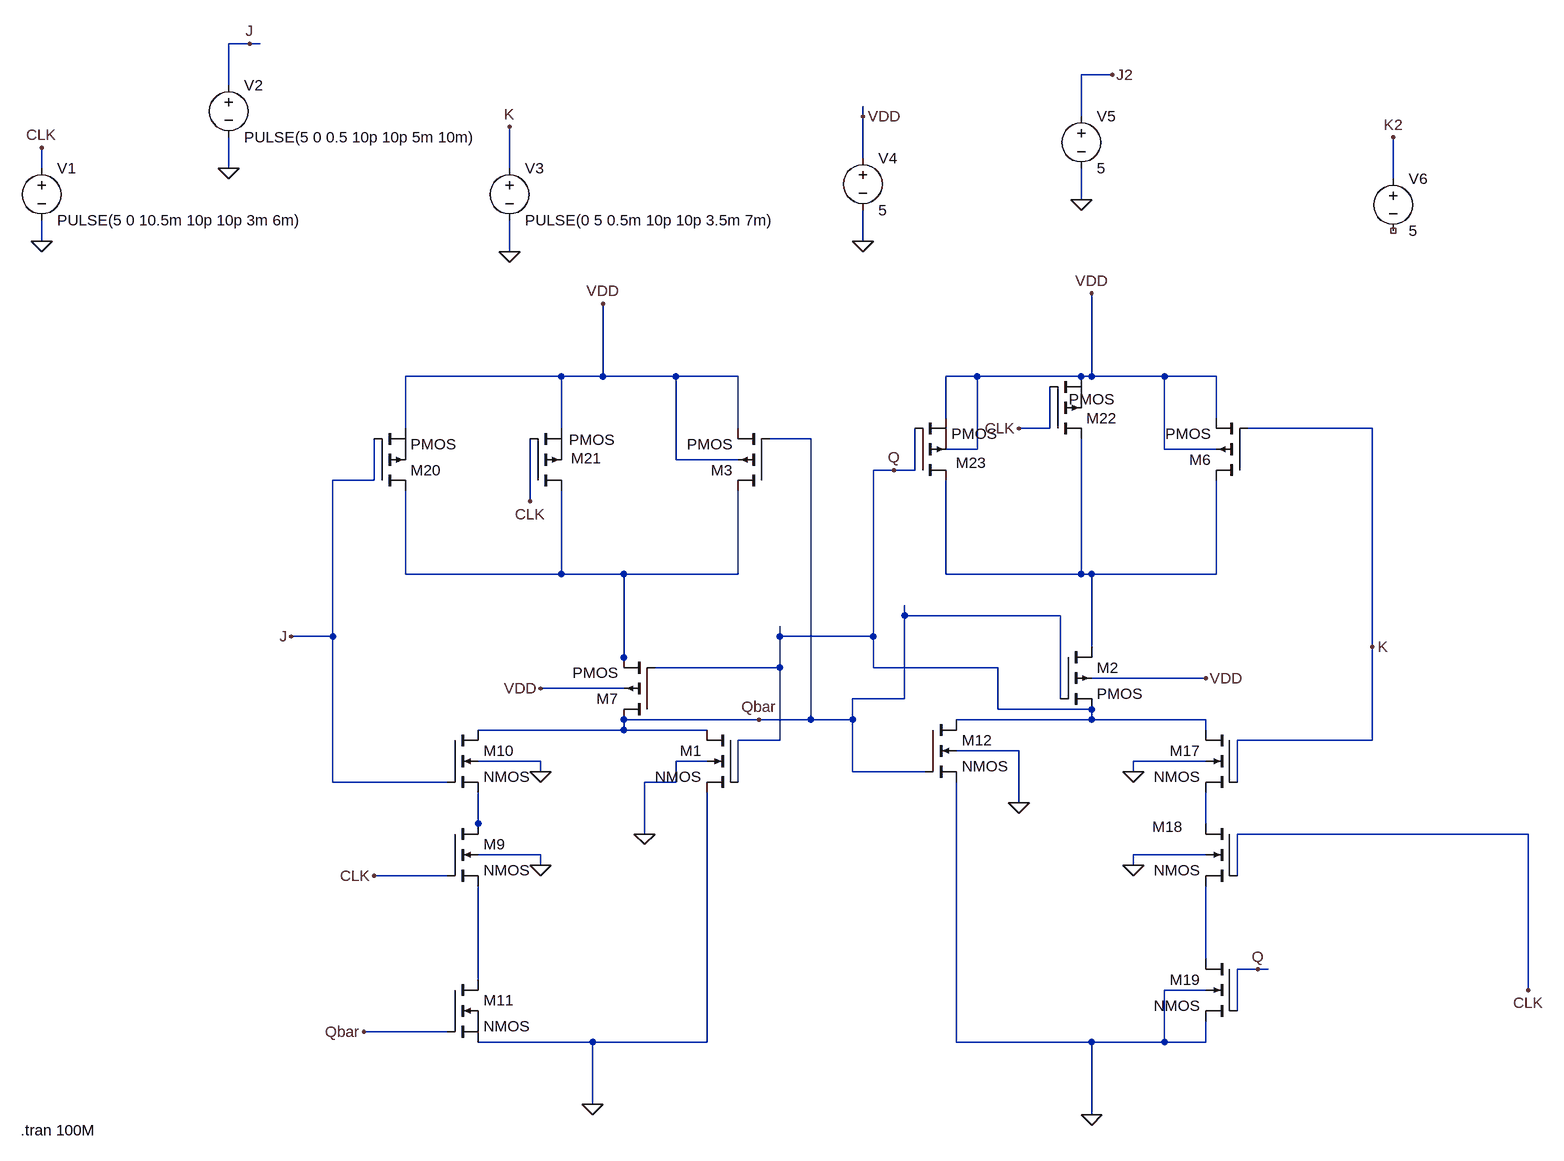
[diagram p0: schematic CIRCUITO.asc]
CIRCUITO.asc, the LTspice schematic file:
Version 4
SHEET 1 2232 1560
WIRE -128 -128 -160 -128
WIRE -112 -128 -128 -128
WIRE 1200 -80 1152 -80
WIRE -160 -64 -160 -128
WIRE 816 -16 816 -32
WIRE 1152 -16 1152 -80
WIRE 816 48 816 -16
WIRE -448 64 -448 32
WIRE -160 64 -160 16
WIRE 272 64 272 0
WIRE 1632 80 1632 16
WIRE 1152 112 1152 64
WIRE -448 176 -448 144
WIRE 816 176 816 128
WIRE 272 192 272 144
WIRE 352 384 112 384
WIRE 416 384 416 272
WIRE 416 384 352 384
WIRE 528 384 416 384
WIRE 624 384 528 384
WIRE 992 384 944 384
WIRE 1152 384 992 384
WIRE 1168 384 1168 256
WIRE 1168 384 1152 384
WIRE 1280 384 1168 384
WIRE 1360 384 1280 384
WIRE 944 448 944 384
WIRE 1360 448 1360 384
WIRE 112 464 112 384
WIRE 352 464 352 384
WIRE 624 464 624 384
WIRE 1104 464 1104 400
WIRE 1104 464 1056 464
WIRE 1600 464 1408 464
WIRE 736 480 672 480
WIRE 992 496 992 384
WIRE 992 496 944 496
WIRE 1280 496 1280 384
WIRE 1360 496 1280 496
WIRE 528 512 528 384
WIRE 624 512 528 512
WIRE 864 528 832 528
WIRE 896 528 896 464
WIRE 896 528 864 528
WIRE 64 544 64 480
WIRE 64 544 0 544
WIRE 304 576 304 480
WIRE 112 688 112 560
WIRE 352 688 352 560
WIRE 352 688 112 688
WIRE 448 688 352 688
WIRE 624 688 624 560
WIRE 624 688 448 688
WIRE 944 688 944 544
WIRE 1152 688 1152 480
WIRE 1152 688 944 688
WIRE 1168 688 1152 688
WIRE 1360 688 1360 544
WIRE 1360 688 1168 688
WIRE 880 752 880 736
WIRE 1120 752 880 752
WIRE 0 784 0 544
WIRE 0 784 -64 784
WIRE 688 784 688 768
WIRE 832 784 832 528
WIRE 832 784 688 784
WIRE 1168 800 1168 688
WIRE 1600 800 1600 464
WIRE 448 816 448 688
WIRE 448 832 448 816
WIRE 688 832 688 784
WIRE 688 832 496 832
WIRE 832 832 832 784
WIRE 1024 832 832 832
WIRE 1344 848 1168 848
WIRE 448 864 320 864
WIRE 880 880 880 752
WIRE 880 880 800 880
WIRE 1120 880 1120 752
WIRE 1024 896 1024 832
WIRE 1168 896 1024 896
WIRE 656 912 448 912
WIRE 736 912 736 480
WIRE 736 912 656 912
WIRE 800 912 800 880
WIRE 800 912 736 912
WIRE 1168 912 1168 896
WIRE 1168 912 960 912
WIRE 1344 912 1168 912
WIRE 448 928 448 912
WIRE 448 928 224 928
WIRE 576 928 448 928
WIRE 1344 928 1344 912
WIRE 688 944 688 832
WIRE 688 944 624 944
WIRE 1600 944 1600 800
WIRE 1600 944 1392 944
WIRE 1056 960 960 960
WIRE 320 976 224 976
WIRE 576 976 528 976
WIRE 1344 976 1232 976
WIRE 320 992 320 976
WIRE 800 992 800 912
WIRE 912 992 800 992
WIRE 1232 992 1232 976
WIRE 0 1008 0 784
WIRE 176 1008 0 1008
WIRE 528 1008 528 976
WIRE 528 1008 480 1008
WIRE 624 1008 624 944
WIRE 1392 1008 1392 944
WIRE 1056 1040 1056 960
WIRE 224 1072 224 1024
WIRE 1344 1072 1344 1024
WIRE 224 1088 224 1072
WIRE 480 1088 480 1008
WIRE 1840 1088 1392 1088
WIRE 320 1120 224 1120
WIRE 1344 1120 1232 1120
WIRE 320 1136 320 1120
WIRE 1232 1136 1232 1120
WIRE 176 1152 64 1152
WIRE 1392 1152 1392 1088
WIRE 1344 1280 1344 1168
WIRE 1424 1296 1392 1296
WIRE 1440 1296 1424 1296
WIRE 224 1312 224 1168
WIRE 1344 1328 1280 1328
WIRE 1840 1328 1840 1088
WIRE 1392 1360 1392 1296
WIRE 176 1392 48 1392
WIRE 400 1408 224 1408
WIRE 576 1408 576 1024
WIRE 576 1408 400 1408
WIRE 960 1408 960 1008
WIRE 1168 1408 960 1408
WIRE 1280 1408 1280 1328
WIRE 1280 1408 1168 1408
WIRE 1344 1408 1344 1376
WIRE 1344 1408 1280 1408
WIRE 400 1504 400 1408
WIRE 1168 1520 1168 1408
FLAG -448 176 0
FLAG -448 32 CLK
FLAG -160 64 0
FLAG 272 192 0
FLAG 320 992 0
FLAG 320 1136 0
FLAG 400 1504 0
FLAG 1168 1520 0
FLAG 1232 1136 0
FLAG 1232 992 0
FLAG 1056 1040 0
FLAG 1056 464 CLK
FLAG 64 1152 CLK
FLAG 1840 1328 CLK
FLAG 416 272 VDD
FLAG 1168 256 VDD
FLAG -64 784 J
FLAG 864 528 Q
FLAG 48 1392 Qbar
FLAG 1344 848 VDD
FLAG 320 864 VDD
FLAG 816 176 0
FLAG 816 -16 VDD
FLAG 656 912 Qbar
FLAG 480 1088 0
FLAG 304 576 CLK
FLAG 1152 112 0
FLAG 1200 -80 J2
FLAG 1632 16 K2
FLAG -128 -128 J
FLAG 272 0 K
FLAG 1424 1296 Q
FLAG 1600 800 K
SYMBOL voltage -448 48 R0
WINDOW 123 0 0 Left 0
WINDOW 39 0 0 Left 0
SYMATTR InstName V1
SYMATTR Value PULSE(5 0 10.5m 10p 10p 3m 6m)
SYMBOL voltage -160 -80 R0
WINDOW 123 0 0 Left 0
WINDOW 39 0 0 Left 0
SYMATTR InstName V2
SYMATTR Value PULSE(5 0 0.5 10p 10p 5m 10m)
SYMBOL voltage 272 48 R0
WINDOW 123 0 0 Left 0
WINDOW 39 0 0 Left 0
SYMATTR InstName V3
SYMATTR Value PULSE(0 5 0.5m 10p 10p 3.5m 7m)
SYMBOL pmos4 672 560 R180
SYMATTR InstName M3
SYMBOL pmos4 1408 544 R180
SYMATTR InstName M6
SYMBOL pmos4 496 912 R180
SYMATTR InstName M7
SYMBOL nmos 176 1312 R0
SYMATTR InstName M11
SYMBOL nmos4 176 1072 R0
SYMATTR InstName M9
SYMBOL nmos4 176 928 R0
SYMATTR InstName M10
SYMBOL nmos4 912 912 R0
SYMATTR InstName M12
SYMBOL voltage 816 32 R0
WINDOW 123 0 0 Left 0
WINDOW 39 0 0 Left 0
SYMATTR InstName V4
SYMATTR Value 5
SYMBOL nmos4 1392 928 M0
SYMATTR InstName M17
SYMBOL nmos4 1392 1072 M0
WINDOW 0 83 5 Left 2
SYMATTR InstName M18
SYMBOL nmos4 1392 1280 M0
SYMATTR InstName M19
SYMBOL pmos 64 560 M180
SYMATTR InstName M20
SYMBOL pmos 304 560 M180
WINDOW 0 63 50 Left 2
WINDOW 3 60 79 Left 2
SYMATTR InstName M21
SYMBOL pmos 1104 480 M180
WINDOW 3 29 61 Left 2
SYMATTR InstName M22
SYMBOL pmos 896 544 M180
WINDOW 0 63 27 Left 2
SYMATTR InstName M23
SYMBOL nmos4 624 928 M0
SYMATTR InstName M1
SYMBOL pmos4 1120 800 R0
SYMATTR InstName M2
SYMBOL voltage 1152 -32 R0
WINDOW 123 0 0 Left 0
WINDOW 39 0 0 Left 0
SYMATTR InstName V5
SYMATTR Value 5
SYMBOL voltage 1632 64 R0
WINDOW 123 0 0 Left 0
WINDOW 39 0 0 Left 0
SYMATTR InstName V6
SYMATTR Value 5
TEXT -480 1544 Left 2 !.tran 100M

The netlist it stands for:
* CIRCUITO.asc
V1 CLK 0 PULSE(5 0 10.5m 10p 10p 3m 6m)
V2 J 0 PULSE(5 0 0.5 10p 10p 5m 10m)
V3 K 0 PULSE(0 5 0.5m 10p 10p 3.5m 7m)
M3 N001 Qbar VDD VDD PMOS
M6 N002 K VDD VDD PMOS
M7 Qbar Q N001 VDD PMOS
M11 N006 Qbar 0 0 NMOS
M9 N003 CLK N006 0 NMOS
M10 Qbar J N003 0 NMOS
M12 Q Qbar 0 0 NMOS
V4 VDD 0 5
M17 Q K N004 0 NMOS
M18 N004 CLK N005 0 NMOS
M19 N005 Q 0 0 NMOS
M20 N001 J VDD VDD PMOS
M21 N001 CLK VDD VDD PMOS
M22 N002 CLK VDD VDD PMOS
M23 N002 Q VDD VDD PMOS
M1 Qbar Q 0 0 NMOS
M2 N002 Qbar Q VDD PMOS
V5 J2 0 5
V6 K2 NC_01 5
.model NMOS NMOS
.model PMOS PMOS
.lib standard.mos
.tran 100M
.backanno
.end